# Altium schematic sheet Схема блока GSM.SchDoc
size 420 x 297 mm; Address1: Address1; Address2: Address2; Address3: Address3; Address4: Address4; DocumentNumber: АБВГ.123456.001 Э3; SheetNumber: 1; Scale: 1:1; DocumentType: Схема электрическая принципиальная; FirstReferrence: АБВГ.123456.001
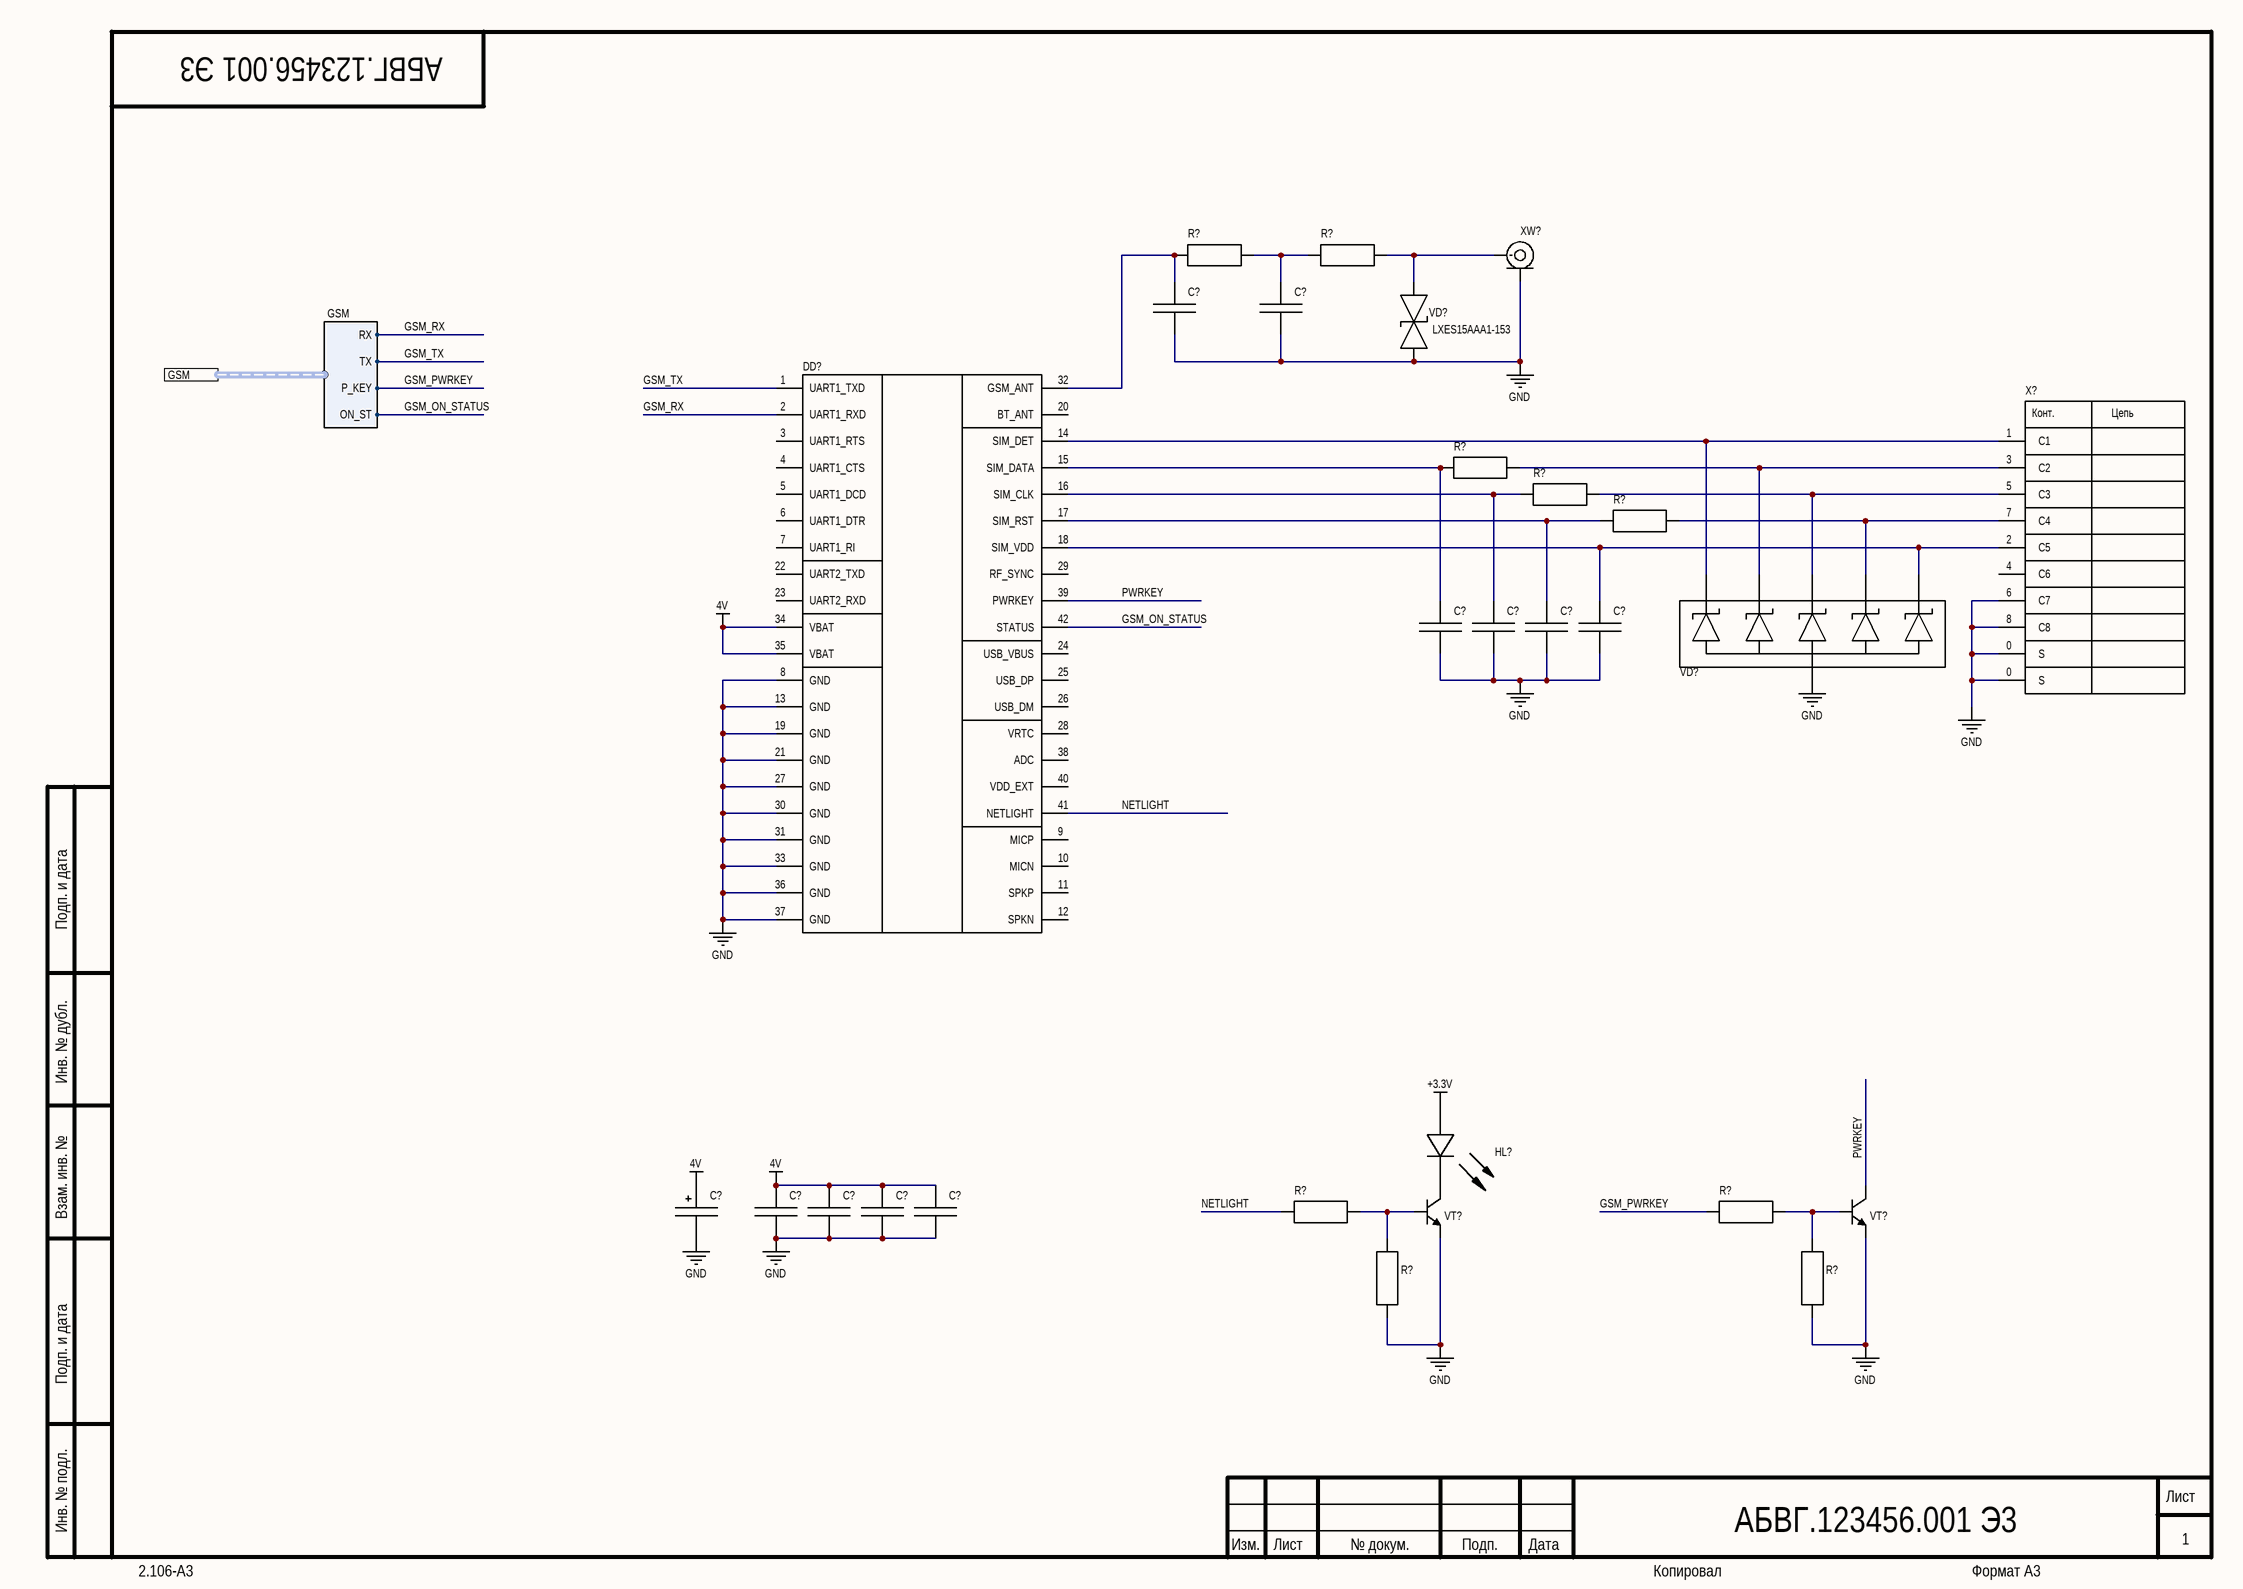
[diagram p0: Схема блока GSM.SchDoc]

## Parts
(Parts that share a designator on the sheet are numbered #1, #2 ... from top to bottom, then left to right.)
C?#1  *  [CH0603C]  (value not drawn)
C?#2  *  [CH0603C]  (value not drawn)
C?#3  *  [CH0603C]  (value not drawn)
C?#4  *  [CH0603C]  (value not drawn)
C?#5  *  [CH0603C]  (value not drawn)
C?#6  *  [CH0603C]  (value not drawn)
C?#7  *  [TANTAL_A]  (value not drawn)
C?#8  *  [CH0603C]  (value not drawn)
C?#9  *  [CH0603C]  (value not drawn)
C?#10  *  [CH0603C]  (value not drawn)
C?#11  *  [CH0603C]  (value not drawn)
DD?  SIM800С  [MOD: SIM800C]  (value not drawn)
HL?  2.1V GREEN  [CH0805LG]  (value not drawn)
R?#1  *  [CH0603R - without silc]  (value not drawn)
R?#2  *  [CH0603R - without silc]  (value not drawn)
R?#3  *  [CH0603R - without silc]  (value not drawn)
R?#4  *  [CH0603R - without silc]  (value not drawn)
R?#5  *  [CH0603R - without silc]  (value not drawn)
R?#6  *  [CH0603R - without silc]  (value not drawn)
R?#7  *  [CH0603R - without silc]  (value not drawn)
R?#8  *  [CH0603R - without silc]  (value not drawn)
R?#9  *  [CH0603R - without silc]  (value not drawn)
VD?#1  LXES15AAA1-153  [CH0402L]
VD?#2  SMF05CT1G  [SOT-363]  (value not drawn)
VT?#1  *  [8-HSOF]  (value not drawn)
VT?#2  *  [8-HSOF]  (value not drawn)
X?  *  [CON: MicroSIM 8P SMD]  (value not drawn)
XW?  SMA  [CON: SMA]  (value not drawn)

## Ports
GSM (harness GSM)

## Harnesses
GSM: RX, TX, P_KEY, ON_ST

## Nets
4V: C?#7.1 C?#8.1 C?#9.1 C?#10.1 C?#11.1 DD?.34(VBAT) DD?.35(VBAT)
+3.3V: HL?.1(A)
GND: C?#1.2 C?#2.2 C?#3.2 C?#4.2 C?#5.2 C?#6.2 C?#7.2 C?#8.2 C?#9.2 C?#10.2 C?#11.2 DD?.8(GND) DD?.13(GND) DD?.19(GND) DD?.21(GND) DD?.27(GND) DD?.30(GND) DD?.31(GND) DD?.33(GND) DD?.36(GND) DD?.37(GND) R?#8.1 R?#9.1 VD?#1.1(A) VD?#2.2 VT?#1.3(E) VT?#2.3(E) X?.0(S) X?.6(C7) X?.8(C8) XW?.2(IN)
GSM_ON_STATUS: DD?.42(STATUS) ; port GSM.ON_ST
GSM_PWRKEY: R?#7.1 ; port GSM.P_KEY
GSM_RX: DD?.2(UART1_RXD) ; port GSM.RX
GSM_TX: DD?.1(UART1_TXD) ; port GSM.TX
NETLIGHT: DD?.41(NETLIGHT) R?#6.1
PWRKEY: DD?.39(PWRKEY) VT?#2.2(C)
NetC?#1_1: C?#1.1 DD?.32(GSM_ANT) R?#1.1
NetC?#2_1: C?#2.1 R?#1.2 R?#2.1
NetC?#3_1: C?#3.1 DD?.15(SIM_DATA) R?#3.1
NetC?#4_1: C?#4.1 DD?.16(SIM_CLK) R?#4.1
NetC?#5_1: C?#5.1 DD?.17(SIM_RST) R?#5.1
NetC?#6_1: C?#6.1 DD?.18(SIM_VDD) VD?#2.6 X?.2(C5)
NetDD?_14: DD?.14(SIM_DET) VD?#2.1 X?.1(C1)
NetHL?_2: HL?.2(C) VT?#1.2(C)
NetR?#2_2: R?#2.2 VD?#1.2(C) XW?.1(IN)
NetR?#3_2: R?#3.2 VD?#2.3 X?.3(C2)
NetR?#4_2: R?#4.2 VD?#2.4 X?.5(C3)
NetR?#5_2: R?#5.2 VD?#2.5 X?.7(C4)
NetR?#6_2: R?#6.2 R?#8.2 VT?#1.1(B)
NetR?#7_2: R?#7.2 R?#9.2 VT?#2.1(B)

Not connected (* = marked no-connect by the designer): DD? 3(UART1_RTS) 4(UART1_CTS) 5(UART1_DCD) 6(UART1_DTR) 7(UART1_RI) 9(MICP) 10(MICN) 11(SPKP) 12(SPKN) 20(BT_ANT) 22(UART2_TXD) 23(UART2_RXD) 24(USB_VBUS) 25(USB_DP) 26(USB_DM) 28(VRTC) 29(RF_SYNC) 38(ADC) 40(VDD_EXT); X? 4(C6)

## Notes on the sheet
- Подп. и дата
- Инв. № дубл.
- Взам. инв. №
- Инв. № подл.
- Изм.
- Лист
- № докум.
- Подп.
- Дата
- 2.106-A3
- Копировал
- Формат А3
- (in symbol 10-Connector) Конт.; Цепь

## Library data of the parts
C?#1-C?#6 C?#8-C?#11 = Capacitor: Manufacturer: *; Model: *; HelpURL: *; ComponentKind: *; Value: *
C?#7 = TantalCap: Manufacturer: *; Model: *; HelpURL: *; ComponentKind: *; Value: *
DD? = SIM800С: GSM; Manufacturer: SIMCom Wireless Solutions; Model: SIM800C; ComponentKind: SMD; HelpURL: http://mt-system.ru/SIMCom/SIM800C
HL? = LED: Manufacturer: Lite-On Inc.; Model: LTST-S220GKT; HelpURL: https://www.digikey.com/en/products/detail/LTST-S220GKT/160-1218-1-ND/337134?utm_campaign=buynow&utm_medium=aggregator&curr=usd&utm_source=octopart; ComponentKind: 0805 (2012 Metric); Value: 2.1V GREEN
R?#1-R?#9 = Resistor: Manufacturer: *; Model: *; HelpURL: *; ComponentKind: *; Value: *
VD?#1 = Diod TVS: Manufacturer: Murata Electronics; ComponentKind: Surface Mount 1005; Model: LXES15AAA1-153; HelpURL: https://www.digikey.com/en/products/detail/murata-electronics/LXES15AAA1-153/5843762?s=N4IgTCBcDaIDIA0CiBlAjAVgII7QWkwGYQBdAXyA
VD?#2 = Diod Schottky Array: Manufacturer: onsemi; ComponentKind: 12.5V Clamp 8A (8/20µs) Ipp Tvs Diode Surface Mount SC-88/SC70-6/SOT-363; Model: SMF05CT1G; HelpURL: https://www.digikey.com/en/products/detail/onsemi/SMF05CT1G/921631?s=N4IgTCBcDaIMoFkBiAGArAYQCoEYDiIAugL5A
VT?#1 VT?#2 = Transistor NPN: Bipolar; Model: *; Manufacturer: *; ComponentKind: *; HelpURL: *
X? = 10-Connector: MicroSIM; Model: *; Manufacturer: *; HelpURL: *; ComponentKind: *
XW? = SMA: RF; Model: *; Manufacturer: *; HelpURL: *; ComponentKind: *